# EAGLE design mbed-motherboard (EAGLE 5.11)
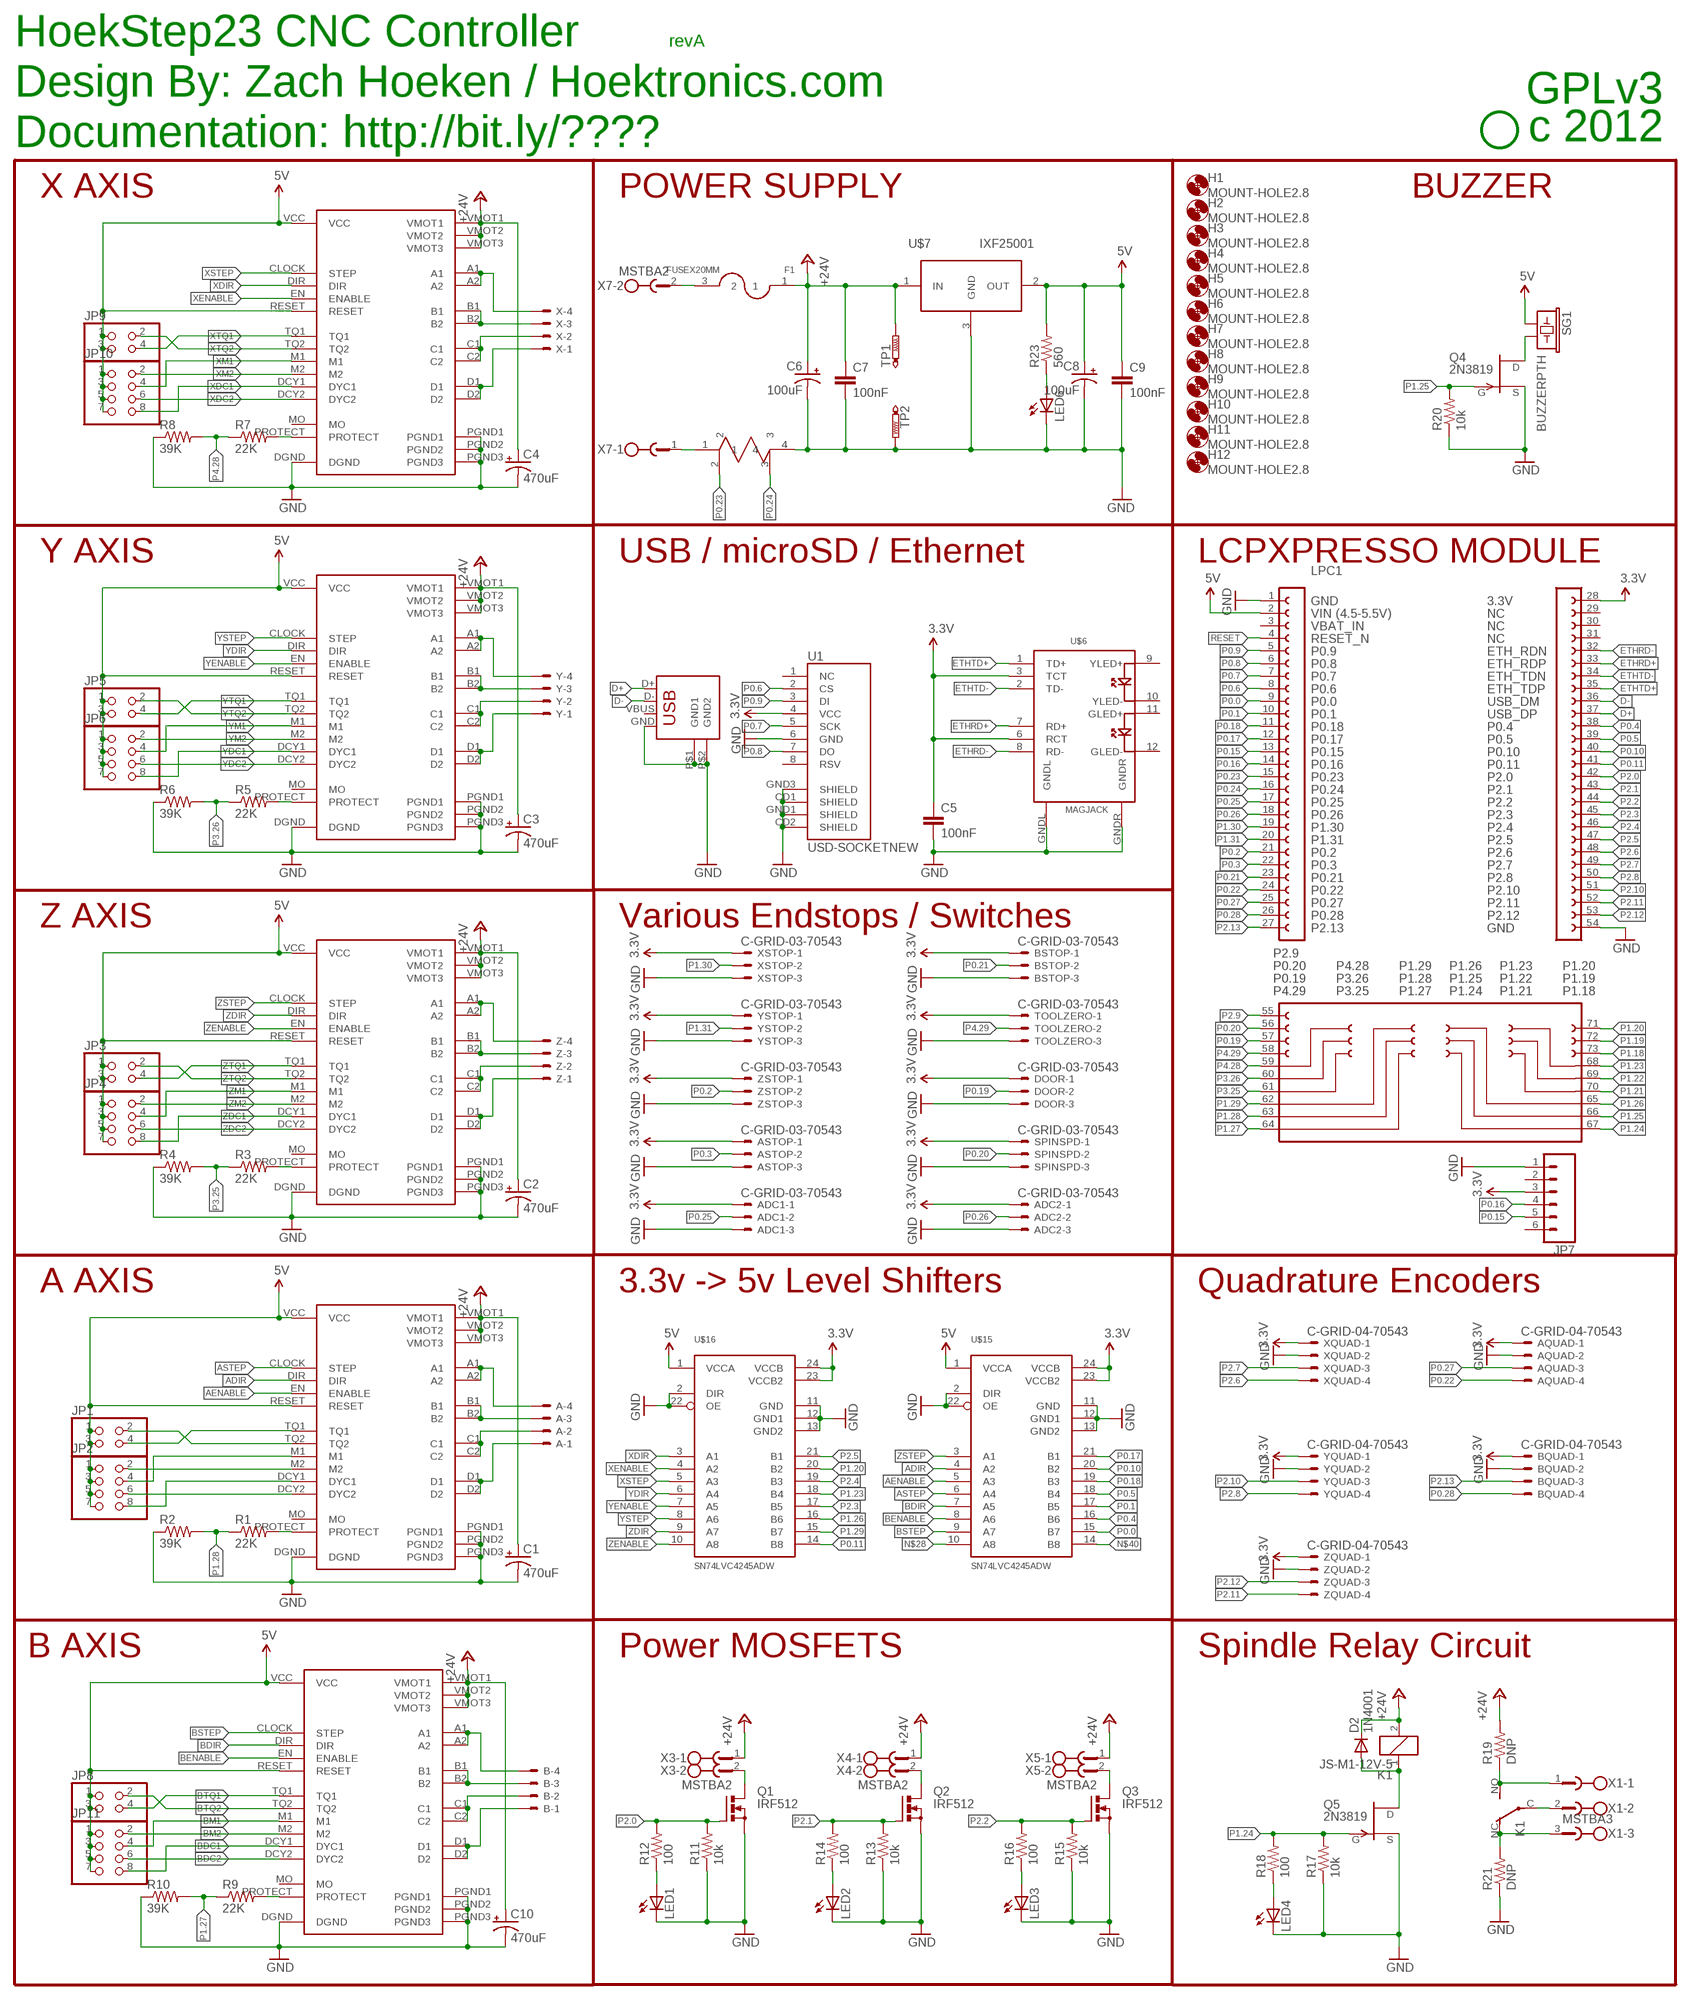
[diagram p0: schematic, sheet 1]

## Parts
A  KK-156-4  [KK-156-4]
ADC1  C-GRID-03-70543  [70543-03]
ADC2  C-GRID-03-70543  [70543-03]
AQUAD  C-GRID-04-70543  [70543-04]
ASTOP  C-GRID-03-70543  [70543-03]
B  KK-156-4  [KK-156-4]
BQUAD  C-GRID-04-70543  [70543-04]
BSTOP  C-GRID-03-70543  [70543-03]
C1  470uF  CPOL-USE3.5-8  [E3,5-8]
C2  470uF  CPOL-USE3.5-8  [E3,5-8]
C3  470uF  CPOL-USE3.5-8  [E3,5-8]
C4  470uF  CPOL-USE3.5-8  [E3,5-8]
C5  100nF  CAP0805  [0805]
C6  100uF  CPOL-USE2.5-7  [E2,5-7]
C7  100nF  CAP0805  [0805]
C8  100uF  CPOL-USE2.5-7  [E2,5-7]
C9  100nF  CAP0805  [0805]
C10  470uF  CPOL-USE3.5-8  [E3,5-8]
D2  1N4001  DIODEPTH  [DIODE-1N4001]
DOOR  C-GRID-03-70543  [70543-03]
F1  FUSEX20MM  [FUSE_5MM]
H1  MOUNT-HOLE2.8  [2,8]
H2  MOUNT-HOLE2.8  [2,8]
H3  MOUNT-HOLE2.8  [2,8]
H4  MOUNT-HOLE2.8  [2,8]
H5  MOUNT-HOLE2.8  [2,8]
H6  MOUNT-HOLE2.8  [2,8]
H7  MOUNT-HOLE2.8  [2,8]
H8  MOUNT-HOLE2.8  [2,8]
H9  MOUNT-HOLE2.8  [2,8]
H10  MOUNT-HOLE2.8  [2,8]
H11  MOUNT-HOLE2.8  [2,8]
H12  MOUNT-HOLE2.8  [2,8]
JP1  PINHD-2X2  [2X02]
JP2  PINHD-2X4  [2X04]
JP3  PINHD-2X2  [2X02]
JP4  PINHD-2X4  [2X04]
JP5  PINHD-2X2  [2X02]
JP6  PINHD-2X4  [2X04]
JP7  M06SIP  [1X06]
JP8  PINHD-2X2  [2X02]
JP9  PINHD-2X2  [2X02]
JP10  PINHD-2X4  [2X04]
JP11  PINHD-2X4  [2X04]
K1  JS-M1-12V-5  [JS-M]
LED1  LED1206  [LED-1206]
LED2  LED1206  [LED-1206]
LED3  LED1206  [LED-1206]
LED4  LED1206  [LED-1206]
LED6  LED1206  [LED-1206]
LPC1  LPCXPRESSO_LPC1769  [LPCXPRESSO_LPC1769]
Q1  IRF512  [TO220BV]
Q2  IRF512  [TO220BV]
Q3  IRF512  [TO220BV]
Q4  2N3819  [TO92]
Q5  2N3819  [TO92]
R1  22K  R-US_R0805  [R0805]
R2  39K  R-US_R0805  [R0805]
R3  22K  R-US_R0805  [R0805]
R4  39K  R-US_R0805  [R0805]
R5  22K  R-US_R0805  [R0805]
R6  39K  R-US_R0805  [R0805]
R7  22K  R-US_R0805  [R0805]
R8  39K  R-US_R0805  [R0805]
R9  22K  R-US_R0805  [R0805]
R10  39K  R-US_R0805  [R0805]
R11  10k  R-US_R0805  [R0805]
R12  100  R-US_R0805  [R0805]
R13  10k  R-US_R0805  [R0805]
R14  100  R-US_R0805  [R0805]
R15  10k  R-US_R0805  [R0805]
R16  100  R-US_R0805  [R0805]
R17  10k  R-US_R0805  [R0805]
R18  100  R-US_R0805  [R0805]
R19  DNP  R-US_R2512  [R2512]
R20  10k  R-US_R0805  [R0805]
R21  DNP  R-US_R2512  [R2512]
R23  560  R-US_R0805  [R0805]
SG1  BUZZERPTH  [BUZZER-12MM]
SPINSPD  C-GRID-03-70543  [70543-03]
TOOLZERO  C-GRID-03-70543  [70543-03]
TP1  PTR1PAD1-13  [P1-13]
TP2  PTR1PAD1-13  [P1-13]
U1  USD-SOCKETNEW  [MICRO-SD-SOCKET-PP]
U$1  HOEKSTEP23  [HOEKSTEP23]
U$2  HOEKSTEP23  [HOEKSTEP23]
U$3  HOEKSTEP23  [HOEKSTEP23]
U$4  HOEKSTEP23  [HOEKSTEP23]
U$6  MAGJACK  [MAGJACK]
U$7  IXF25001  [TO252]
U$9  HOEKSTEP23  [HOEKSTEP23]
U$15  SN74LVC4245ADW  [SO24W]
U$16  SN74LVC4245ADW  [SO24W]
U$19  WSL3637  [WSL3637]
X  KK-156-4  [KK-156-4]
X1  MSTBA3  [MSTBA3]
X2  USBPTH  [USB-B-PTH]
X3  MSTBA2  [MSTBA2]
X4  MSTBA2  [MSTBA2]
X5  MSTBA2  [MSTBA2]
X7  MSTBA2  [MSTBA2]
XQUAD  C-GRID-04-70543  [70543-04]
XSTOP  C-GRID-03-70543  [70543-03]
Y  KK-156-4  [KK-156-4]
YQUAD  C-GRID-04-70543  [70543-04]
YSTOP  C-GRID-03-70543  [70543-03]
Z  KK-156-4  [KK-156-4]
ZQUAD  C-GRID-04-70543  [70543-04]
ZSTOP  C-GRID-03-70543  [70543-03]

## Nets
3.3V: ADC1.1 ADC2.1 AQUAD.1 ASTOP.1 BQUAD.1 BSTOP.1 C5.1 DOOR.1 JP7.3 LPC1.28 SPINSPD.1 TOOLZERO.1 U1.4(VCC) U$6.3(TCT) U$6.6(RCT) U$15.23(VCCB2) U$15.24(VCCB) U$16.23(VCCB2) U$16.24(VCCB) XQUAD.1 XSTOP.1 YQUAD.1 YSTOP.1 ZQUAD.1 ZSTOP.1
5V: C8.+ C9.1 JP1.1 JP1.3 JP2.1 JP2.3 JP2.5 JP2.7 JP3.1 JP3.3 JP4.1 JP4.3 JP4.5 JP4.7 JP5.1 JP5.3 JP6.1 JP6.3 JP6.5 JP6.7 JP8.1 JP8.3 JP9.1 JP9.3 JP10.1 JP10.3 JP10.5 JP10.7 JP11.1 JP11.3 JP11.5 JP11.7 LPC1.2 R23.2 SG1.+ U$1.RESET U$1.VCC U$2.RESET U$2.VCC U$3.RESET U$3.VCC U$4.RESET U$4.VCC U$7.2(OUT) U$9.RESET U$9.VCC U$15.1(VCCA) U$16.1(VCCA)
+24V [power]: C1.+ C2.+ C3.+ C4.+ C6.+ C7.1 C10.+ D2.C F1.1 K1.2 R19.2 TP1.TP U$1.VMOT1 U$1.VMOT2 U$1.VMOT3 U$2.VMOT1 U$2.VMOT2 U$2.VMOT3 U$3.VMOT1 U$3.VMOT2 U$3.VMOT3 U$4.VMOT1 U$4.VMOT2 U$4.VMOT3 U$7.1(IN) U$9.VMOT1 U$9.VMOT2 U$9.VMOT3 X3.1 X4.1 X5.1
ADC1 [power]: JP2.8 U$4.DCY1(DYC1)
ADC2 [power]: JP2.6 U$4.DCY2(DYC2)
ADIR: U$4.DIR U$15.4(A2)
AENABLE: U$4.EN(ENABLE) U$15.5(A3)
AM1 [power]: JP2.4 U$4.M1
AM2 [power]: JP2.2 U$4.M2
ASTEP: U$4.CLOCK(STEP) U$15.6(A4)
ATQ1 [power]: JP1.4 U$4.TQ1
ATQ2 [power]: JP1.2 U$4.TQ2
BDC1 [power]: JP11.8 U$9.DCY1(DYC1)
BDC2 [power]: JP11.6 U$9.DCY2(DYC2)
BDIR: U$9.DIR U$15.7(A5)
BENABLE: U$9.EN(ENABLE) U$15.8(A6)
BM1 [power]: JP11.4 U$9.M1
BM2 [power]: JP11.2 U$9.M2
BSTEP: U$9.CLOCK(STEP) U$15.9(A7)
BTQ1 [power]: JP8.4 U$9.TQ1
BTQ2 [power]: JP8.2 U$9.TQ2
D+: LPC1.37 X2.D+
D-: LPC1.36 X2.D-
ETHRD+: LPC1.33 U$6.7(RD+)
ETHRD-: LPC1.32 U$6.8(RD-)
ETHTD+: LPC1.35 U$6.1(TD+)
ETHTD-: LPC1.34 U$6.2(TD-)
GND: ADC1.3 ADC2.3 AQUAD.2 ASTOP.3 BQUAD.2 BSTOP.3 C1.- C2.- C3.- C4.- C5.2 C6.- C7.2 C8.- C9.2 C10.- DOOR.3 JP7.1 LED1.C LED2.C LED3.C LED4.C LED6.C LPC1.1 LPC1.54 Q1.S Q2.S Q3.S Q4.3(S) Q5.3(S) R2.1 R4.1 R6.1 R8.1 R10.1 R11.1 R13.1 R15.1 R17.1 R20.1 R21.1 SPINSPD.3 TOOLZERO.3 TP2.TP U1.6(GND) U1.CD1(SHIELD) U1.CD2(SHIELD) U1.GND1(SHIELD) U1.GND3(SHIELD) U$1.DGND U$1.PGND1 U$1.PGND2 U$1.PGND3 U$2.DGND U$2.PGND1 U$2.PGND2 U$2.PGND3 U$3.DGND U$3.PGND1 U$3.PGND2 U$3.PGND3 U$4.DGND U$4.PGND1 U$4.PGND2 U$4.PGND3 U$6.GNDL U$6.GNDR U$7.3(GND) U$9.DGND U$9.PGND1 U$9.PGND2 U$9.PGND3 U$15.2(DIR) U$15.11(GND) U$15.12(GND1) U$15.13(GND2) U$15.22(OE) U$16.2(DIR) U$16.11(GND) U$16.12(GND1) U$16.13(GND2) U$16.22(OE) U$19.4 X2.GND X2.P$1(GND1) X2.P$2(GND2) XQUAD.2 XSTOP.3 YQUAD.2 YSTOP.3 ZQUAD.2 ZSTOP.3
N$1 [power]: U$3.C1 U$3.C2 Z.2
N$2 [power]: A.2 U$4.C1 U$4.C2
N$3 [power]: A.3 U$4.B1 U$4.B2
N$4 [power]: A.4 U$4.A1 U$4.A2
N$5 [power]: A.1 U$4.D1 U$4.D2
N$6: F1.3 X7.2
N$7 [power]: B.2 U$9.C1 U$9.C2
N$8: R3.2 U$3.PROTECT
N$9 [power]: U$3.B1 U$3.B2 Z.3
N$10 [power]: U$3.A1 U$3.A2 Z.4
N$11 [power]: U$3.D1 U$3.D2 Z.1
N$12 [power]: B.3 U$9.B1 U$9.B2
N$13 [power]: B.4 U$9.A1 U$9.A2
N$14 [power]: B.1 U$9.D1 U$9.D2
N$15: K1.NO(2:S) R19.1 X1.1
N$16: R1.2 U$4.PROTECT
N$17: Q1.D X3.2
N$18: LED1.A R12.1
N$19: Q2.D X4.2
N$20: LED2.A R14.1
N$21 [power]: U$2.C1 U$2.C2 Y.2
N$22 [power]: U$2.B1 U$2.B2 Y.3
N$23 [power]: U$2.A1 U$2.A2 Y.4
N$24 [power]: U$2.D1 U$2.D2 Y.1
N$25: Q3.D X5.2
N$26: LED3.A R16.1
N$27: U$19.1 X7.1
N$28: U$15.10(A8)
N$29: K1.C(2:P) X1.2
N$30: D2.A K1.1 Q5.1(D)
N$31 [power]: U$1.C1 U$1.C2 X.2
N$32 [power]: U$1.B1 U$1.B2 X.3
N$33 [power]: U$1.A1 U$1.A2 X.4
N$34 [power]: U$1.D1 U$1.D2 X.1
N$35: LED4.A R18.1
N$37: K1.NC(2:O) R21.2 X1.3
N$38: Q4.1(D) SG1.-
N$39: LED6.A R23.1
N$40: U$15.14(B8)
N$42: R9.2 U$9.PROTECT
N$43: R7.2 U$1.PROTECT
N$44: R5.2 U$2.PROTECT
P0.0: LPC1.9 U$15.15(B7)
P0.1: LPC1.10 U$15.17(B5)
P0.2: LPC1.21 ZSTOP.2
P0.3: ASTOP.2 LPC1.22
P0.4: LPC1.38 U$15.16(B6)
P0.5: LPC1.39 U$15.18(B4)
P0.6: LPC1.8 U1.2(CS)
P0.7: LPC1.7 U1.5(SCK)
P0.8: LPC1.6 U1.7(DO)
P0.9: LPC1.5 U1.3(DI)
P0.10: LPC1.40 U$15.20(B2)
P0.11: LPC1.41 U$16.14(B8)
P0.15: JP7.5 LPC1.13
P0.16: JP7.4 LPC1.14
P0.17: LPC1.12 U$15.21(B1)
P0.18: LPC1.11 U$15.19(B3)
P0.19: DOOR.2 LPC1.57
P0.20: LPC1.56 SPINSPD.2
P0.21: BSTOP.2 LPC1.23
P0.22: AQUAD.4 LPC1.24
P0.23: LPC1.15 U$19.2
P0.24: LPC1.16 U$19.3
P0.25: ADC1.2 LPC1.17
P0.26: ADC2.2 LPC1.18
P0.27: AQUAD.3 LPC1.25
P0.28: BQUAD.4 LPC1.26
P1.18: LPC1.73
P1.19: LPC1.72
P1.20: LPC1.71 U$16.20(B2)
P1.21: LPC1.70
P1.22: LPC1.69
P1.23: LPC1.68 U$16.18(B4)
P1.24: LPC1.67 Q5.2(G) R17.2 R18.2
P1.25: LPC1.66 Q4.2(G) R20.2
P1.26: LPC1.65 U$16.16(B6)
P1.27: LPC1.64 R9.1 R10.2
P1.28: LPC1.63 R1.1 R2.2
P1.29: LPC1.62 U$16.15(B7)
P1.30: LPC1.19 XSTOP.2
P1.31: LPC1.20 YSTOP.2
P2.0: LPC1.42 Q1.G R11.2 R12.2
P2.1: LPC1.43 Q2.G R13.2 R14.2
P2.2: LPC1.44 Q3.G R15.2 R16.2
P2.3: LPC1.45 U$16.17(B5)
P2.4: LPC1.46 U$16.19(B3)
P2.5: LPC1.47 U$16.21(B1)
P2.6: LPC1.48 XQUAD.4
P2.7: LPC1.49 XQUAD.3
P2.8: LPC1.50 YQUAD.4
P2.9: LPC1.55
P2.10: LPC1.51 YQUAD.3
P2.11: LPC1.52 ZQUAD.4
P2.12: LPC1.53 ZQUAD.3
P2.13: BQUAD.3 LPC1.27
P3.25: LPC1.61 R3.1 R4.2
P3.26: LPC1.60 R5.1 R6.2
P4.28: LPC1.59 R7.1 R8.2
P4.29: LPC1.58 TOOLZERO.2
RESET: LPC1.4
XDC1 [power]: JP10.8 U$1.DCY1(DYC1)
XDC2 [power]: JP10.6 U$1.DCY2(DYC2)
XDIR: U$1.DIR U$16.3(A1)
XENABLE: U$1.EN(ENABLE) U$16.4(A2)
XM1 [power]: JP10.4 U$1.M1
XM2 [power]: JP10.2 U$1.M2
XSTEP: U$1.CLOCK(STEP) U$16.5(A3)
XTQ1 [power]: JP9.4 U$1.TQ1
XTQ2 [power]: JP9.2 U$1.TQ2
YDC1 [power]: JP6.8 U$2.DCY1(DYC1)
YDC2 [power]: JP6.6 U$2.DCY2(DYC2)
YDIR: U$2.DIR U$16.6(A4)
YENABLE: U$2.EN(ENABLE) U$16.7(A5)
YM1 [power]: JP6.4 U$2.M1
YM2 [power]: JP6.2 U$2.M2
YSTEP: U$2.CLOCK(STEP) U$16.8(A6)
YTQ1 [power]: JP5.4 U$2.TQ1
YTQ2 [power]: JP5.2 U$2.TQ2
ZDC1 [power]: JP4.8 U$3.DCY1(DYC1)
ZDC2 [power]: JP4.6 U$3.DCY2(DYC2)
ZDIR: U$3.DIR U$16.9(A7)
ZENABLE: U$3.EN(ENABLE) U$16.10(A8)
ZM1 [power]: JP4.4 U$3.M1
ZM2 [power]: JP4.2 U$3.M2
ZSTEP: U$3.CLOCK(STEP) U$15.3(A1)
ZTQ1 [power]: JP3.4 U$3.TQ1
ZTQ2 [power]: JP3.2 U$3.TQ2
Unconnected: JP7.2 JP7.6 LPC1.3 LPC1.29 LPC1.30 LPC1.31 U1.1(NC) U1.8(RSV) U$1.MO U$2.MO U$3.MO U$4.MO U$6.9(YLED+) U$6.10(YLED-) U$6.11(GLED+) U$6.12(GLED-) U$9.MO X2.VBUS

## Notes on the sheet
- HoekStep23 CNC Controller | revA
- GPLv3
- Design By: Zach Hoeken / Hoektronics.com | c 2012
- Documentation: http://bit.ly/????
- X AXIS | POWER SUPPLY | BUZZER
- Y AXIS | USB / microSD / Ethernet | LCPXPRESSO MODULE
- Z AXIS | Various Endstops / Switches
- A AXIS | 3.3v -> 5v Level Shifters | Quadrature Encoders
- B AXIS | Power MOSFETS | Spindle Relay Circuit

## Library data of the parts
A B X Y Z = con-molex:KK-156-4: KK 156 HEADER Source: http://www.molex.com/pdm_docs/sd/026604100_sd.pdf; OC_FARNELL: unknown; OC_NEWARK: unknown
ADC1 ADC2 ASTOP BSTOP DOOR SPINSPD TOOLZERO XSTOP YSTOP ZSTOP = con-molex:C-GRID-03: CONNECTOR wire to board 2.54 mm (0.100") pitch header; OC_FARNELL: unknown; OC_NEWARK: unknown
AQUAD BQUAD XQUAD YQUAD ZQUAD = con-molex:C-GRID-04: CONNECTOR wire to board 2.54 mm (0.100") pitch header; OC_FARNELL: unknown; OC_NEWARK: unknown
C1-C4 C6 C8 C10 = rcl:CPOL-US: POLARIZED CAPACITOR, American symbol
C5 C7 C9 = SparkFun:CAP: Capacitor Standard 0603 ceramic capacitor, and 0.1" leaded capacitor.
D2 = SparkFun:DIODE: Diode These are standard reverse protection diodes and small signal diodes. SMA package can handle up to about 1A. SOD-323 can handle about 200mA. What the SOD-323 package when ordering, there are some mfgs out there that are 5-pin packages.
F1 = SparkFun:FUSE
H1-H12 = holes:MOUNT-HOLE: MOUNTING HOLE with drill center marker
JP1 JP3 JP5 JP8 JP9 = pinhead:PINHD-2X2: PIN HEADER
JP2 JP4 JP6 JP10 JP11 = pinhead:PINHD-2X4: PIN HEADER
JP7 = SparkFun:M06: Header 6 Standard 6-pin 0.1" header. Use with straight break away headers (SKU : PRT-00116), right angle break away headers (PRT-00553), swiss pins (PRT-00743), machine pins (PRT-00117), and female headers (PRT-00115). Molex polarized connector foot print use with SKU : PRT-08094 with associated crimp pins and housings. NOTES ON THE VARIANTS LOCK and LOCK_LONGPADS... This footprint was designed to help hold the alignment of a through-hole component (i.e. 6-pin header) while soldering it into place. You may notice that each hole has been shifted either up or down by 0.005 of an inch from it's more standard position (which is a perfectly straight line). This slight alteration caused the pins (the squares in the middle) to touch the edges of the holes. Because they are alternating, it causes a "brace" to hold the component in place. 0.005 has proven to be the perfect amount of "off-center" position when using our standard breakaway headers. Although looks a little odd when you look at the bare footprint, once you have a header in there, the alteration is very hard to notice. Also, if you push a header all the way into place, it is covered up entirely on the bottom side. This idea of altering the position of holes to aid alignment will be further integrated into the Sparkfun Library for other footprints. It can help hold any component with 3 or more connection pins.
K1 = relay:JS-M1*: Automotive Ultra-Miniature Power Relay NAiS Source: http://www.mew-europe.com/.. en_ds_61211_0000.pdf
LED1-LED4 LED6 = SparkFun:LED: LEDs Standard schematic elements and footprints for 5mm, 3mm, 1206, and 0603 sized LEDs. 5mm - Spark Fun Electronics SKU : COM-00529 (and others)
LPC1 = LPCXpresso_boards:LPCXPRESSO_LPC1769
Q1-Q3 = transistor-power:IRF512: N-CHANNEL MOS FET
Q4 Q5 = transistor-fet:2N3819: N-Channel Junction FET
R1-R21 R23 = resistor:R-US_: RESISTOR, American symbol
SG1 = SparkFun:BUZZER: Buzzer 12mm Spark Fun Electronics SKU : Comp-Buzzer
TP1 TP2 = testpad:PTR1: TEST PIN
U1 = SparkFun:USD-SOCKET: microSD Socket Push-push type uSD socket. Schematic element and footprint production proven. Spark Fun Electronics SKU : PRT-00127. tDoc lines correctly indicate media card edge positions when inserting (unlocked, locked, depressed).
U$1-U$4 U$9 = Hoektronics:HOEKSTEP23
U$6 = Hoektronics:MAGJACK
U$7 = Hoektronics:IXF25001
U$15 U$16 = MakerBot:SN74LVC4245A
U$19 = Hoektronics:WSL3637
X1 = con-phoenix-508:MSTBA3: PHOENIX; MF: FARNELL; MPN: 1757255; OC_FARNELL: 3705183; OC_NEWARK: 71C4162
X2 = Hoektronics:USB: USB Connectors USB-B-PTH is fully proven SKU : PRT-00139 USB-miniB is fully proven SKU : PRT-00587 USB-A-PCB is untested. USB-A-H is throughly reviewed, but untested. Spark Fun Electronics SKU : PRT-00437 USB-B-SMT is throughly reviewed, but untested. Needs silkscreen touching up. USB-A-S has not been used/tested USB-MB-H has not been used/tested
X3-X5 X7 = con-phoenix-508:MSTBA2: PHOENIX; MF: FARNELL; MPN: 1757242; OC_FARNELL: 3705171; OC_NEWARK: 71C4161

## Net classes
0 default: width 0.406 mm, clearance 0.381 mm
1 power: width 1.27 mm, clearance 0.635 mm

## Board
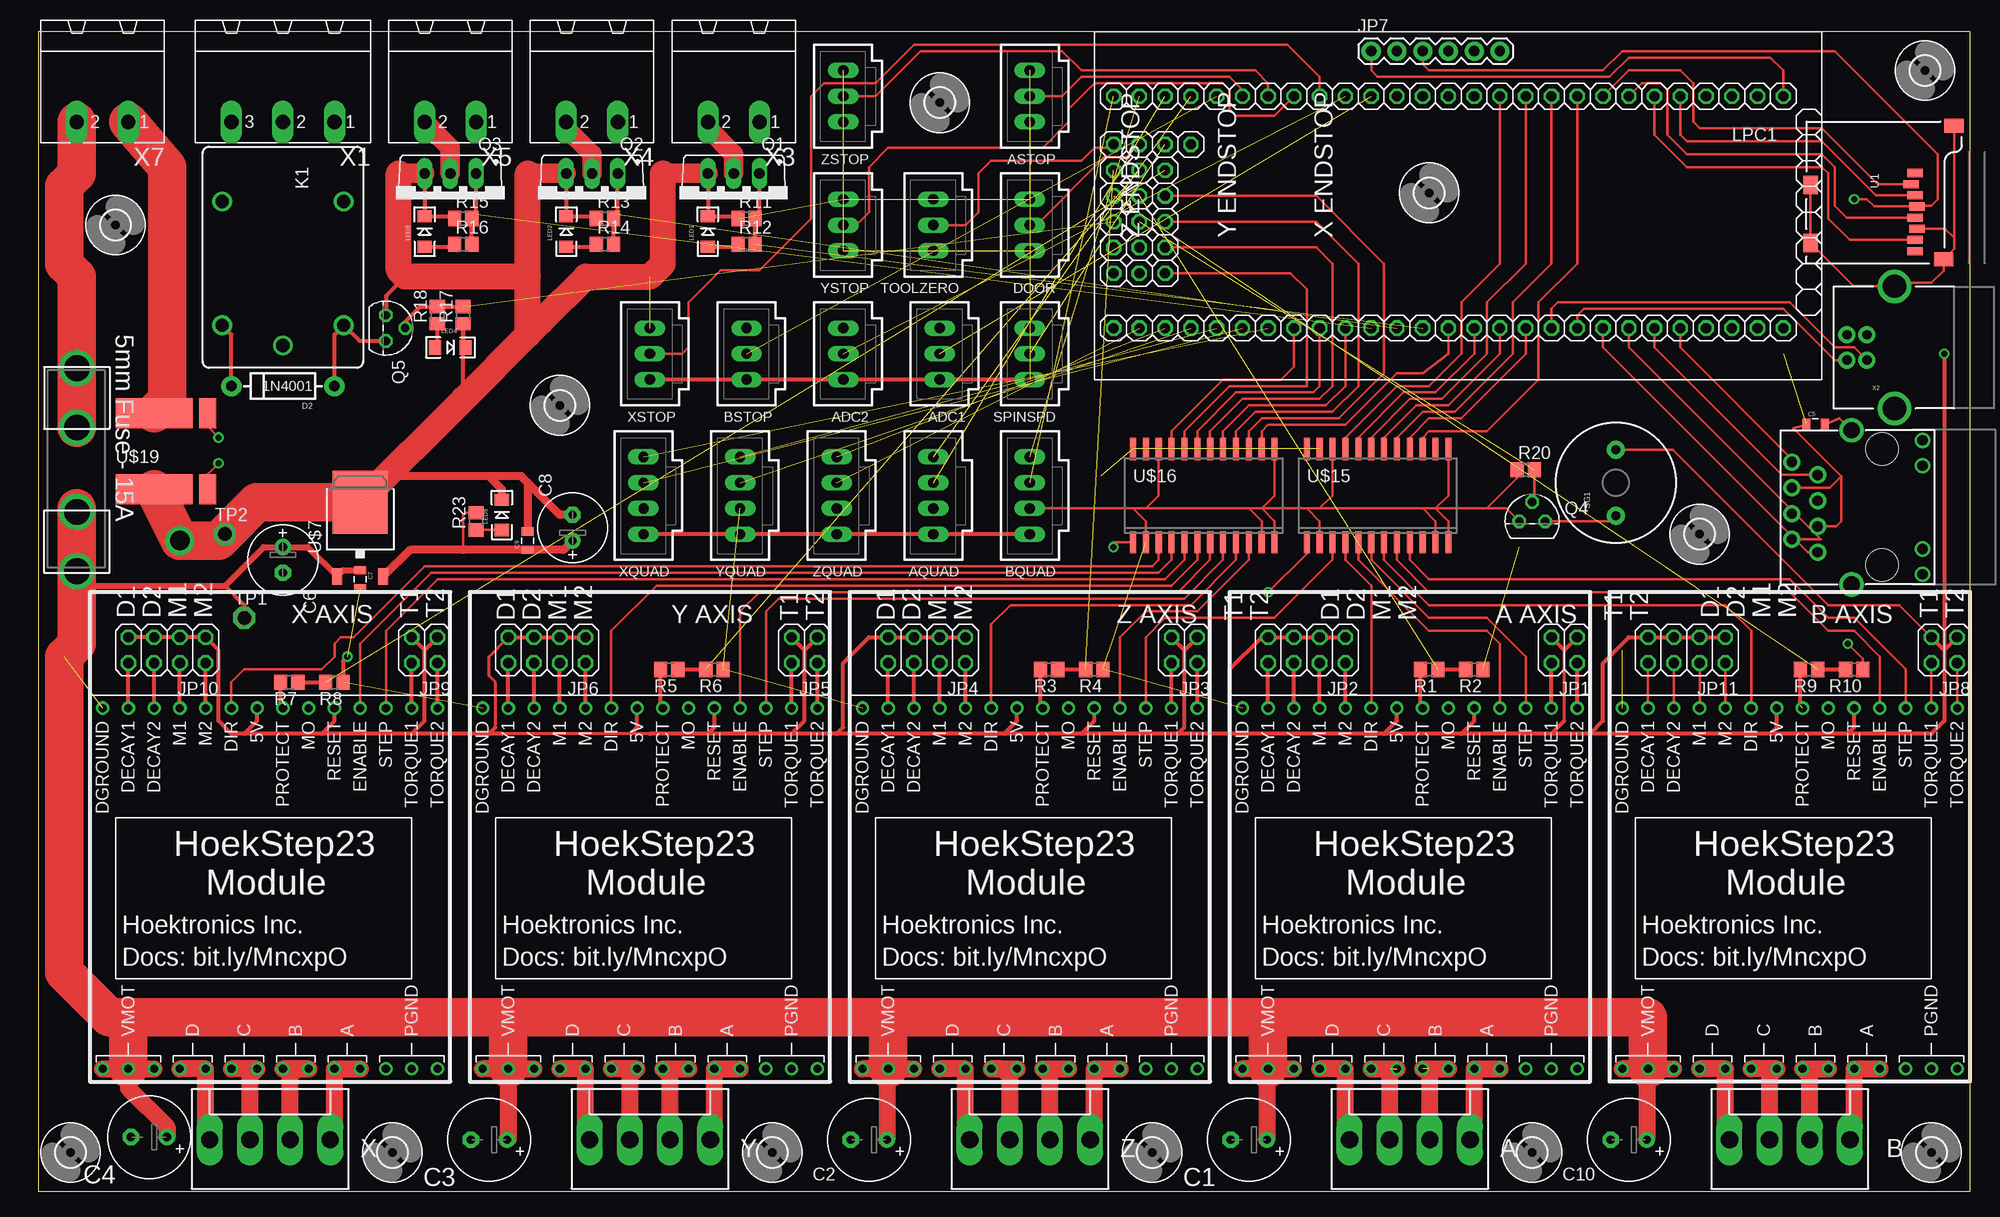
[diagram p1: board, top side]
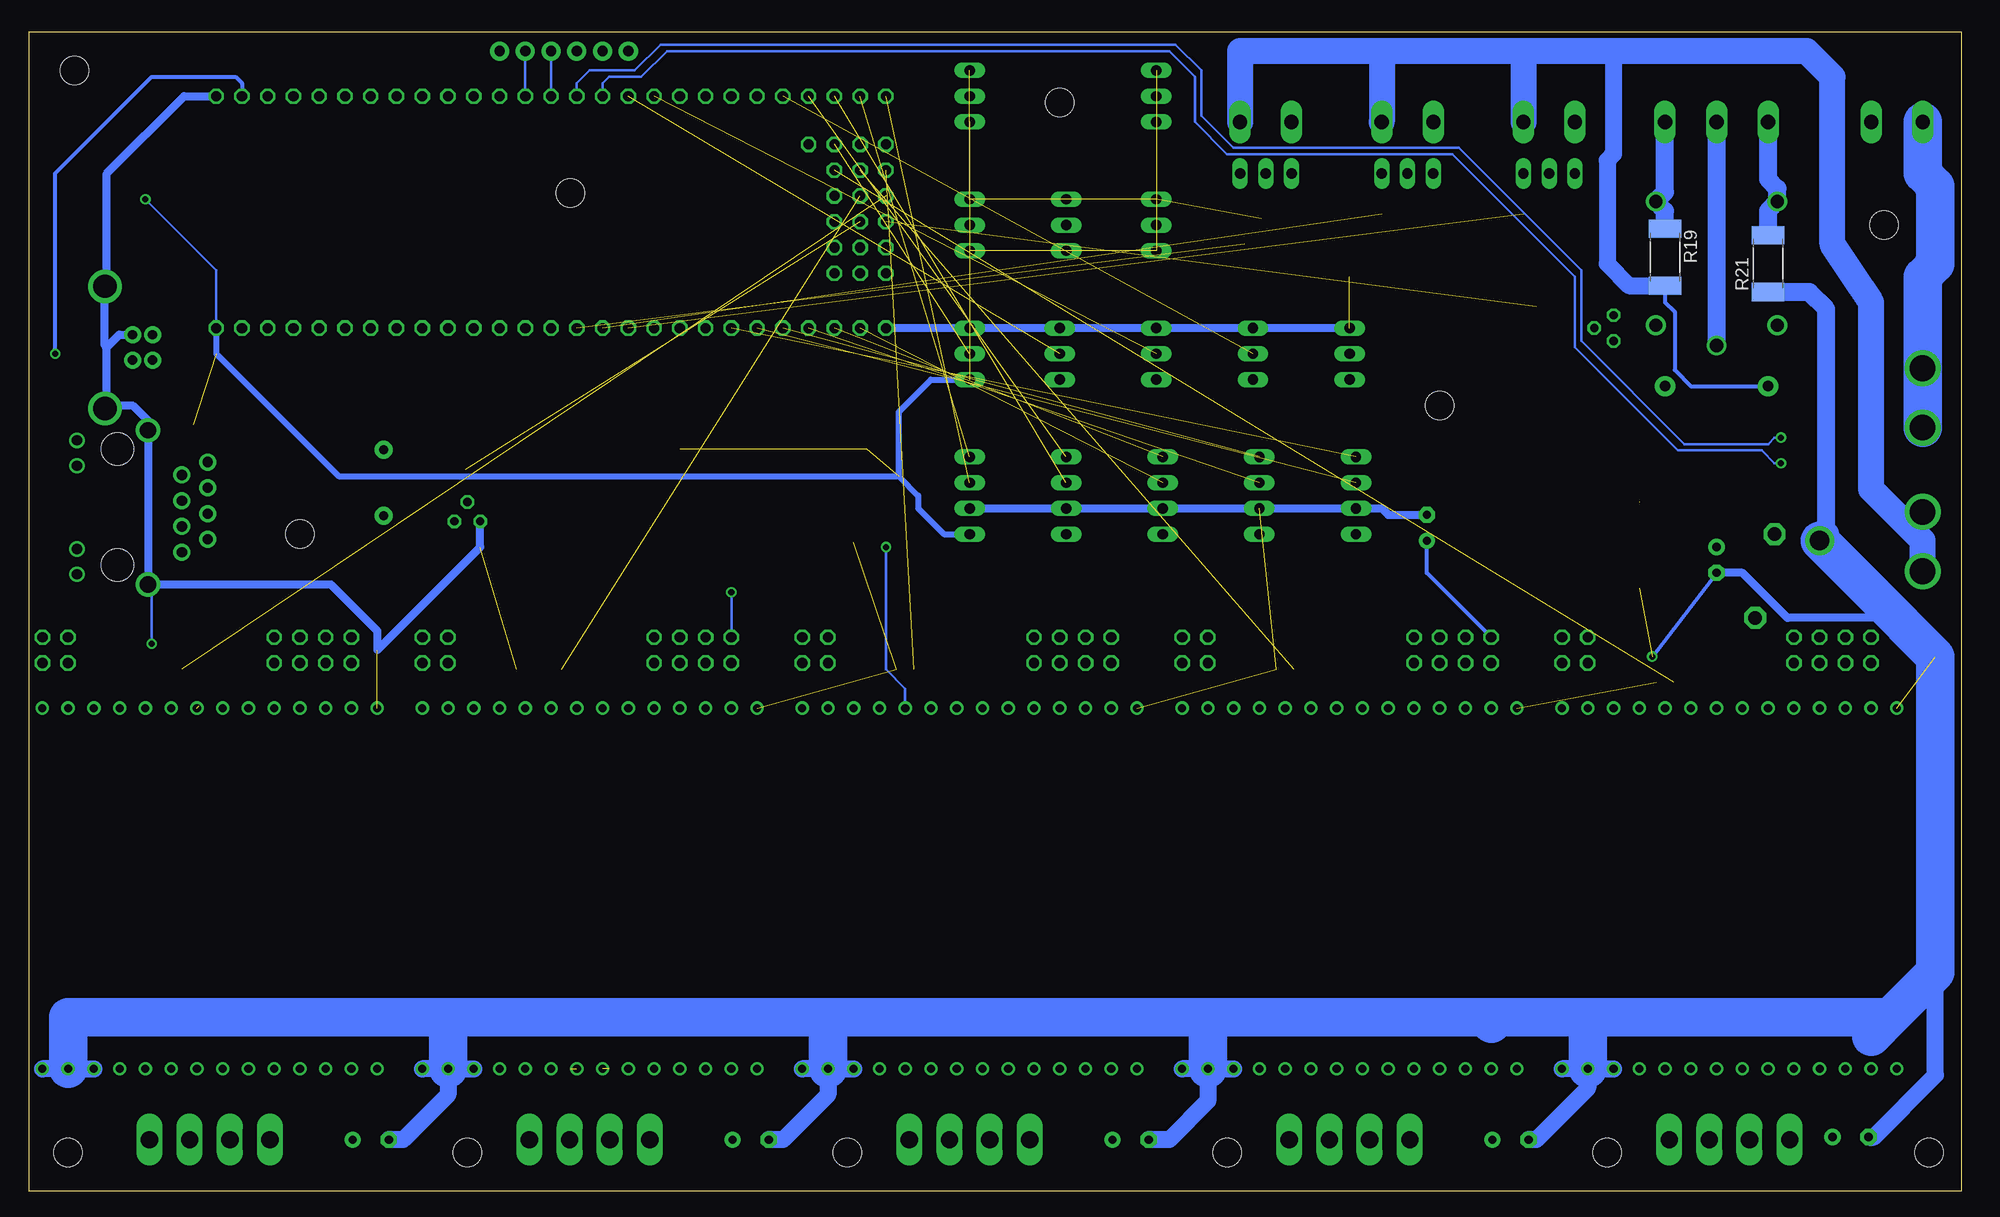
[diagram p2: board, bottom side, seen from below]

Size 190.5 x 114.3 mm. Coordinates in mm from the lower left corner, seen from the top.
Outline: 190.5,114.3 0,114.3 0,0 190.5,0 190.5,114.3
Copper layers (1*16): Top 0.035mm / dielectric 1.5mm / Bottom 0.035mm
Design rules "default *": minimum track width 10mil, minimum drill 24mil, track to track 15mil, track to pad 15mil, pad to pad 15mil, via to via 15mil, smd to smd 15mil, copper to edge 25mil, drill to drill 15mil, minimum pad ring 10mil, minimum via ring 8mil, stop-mask expansion 4mil, vias tented up to drill 0mil, thermal gap 10mil

### Footprints (pad centres in the part's own frame; a part is rotated, then mirrored left to right if it is on the bottom)
KK-156-4 = drill 1.7 pad 2.184 long: 1 -5.94,0; 2 -1.98,0; 3 1.98,0; 4 5.94,0
70543-03 = drill 1.016 long: 1 -2.54,0; 2 0,0; 3 2.54,0
70543-04 = drill 1.016 long: 1 -3.81,0; 2 -1.27,0; 3 1.27,0; 4 3.81,0
E3,5-8 = drill 0.813 pad 1.6 round: + -1.778,0 | drill 0.813 pad 1.6 octagon: - 1.778,0
0805 = smd 0.8 x 1.2: 1 -0.9,0; 2 0.9,0
E2,5-7 = drill 0.813 pad 1.6 round: + -1.27,0 | drill 0.813 pad 1.6 octagon: - 1.27,0
DIODE-1N4001 = drill 1 pad 1.981 round: A -5.08,0; C 5.08,0
FUSE_5MM = drill 2.54 pad 3.556 round: 1 0,-10; 2 0,-4.158; 3 0,4.158; 4 0,10
2,8 = hole 2.8: 0,0
2X02 = drill 1.016 octagon: 1 -1.27,-1.27; 2 -1.27,1.27; 3 1.27,-1.27; 4 1.27,1.27
2X04 = drill 1.016 octagon: 1 -3.81,-1.27; 2 -3.81,1.27; 3 -1.27,-1.27; 4 -1.27,1.27; 5 1.27,-1.27; 6 1.27,1.27; 7 3.81,-1.27; 8 3.81,1.27
1X06 = drill 1.016 pad 1.88 round: 1 0,0; 2 2.54,0; 3 5.08,0; 4 7.62,0; 5 10.16,0; 6 12.7,0
JS-M = drill 1.3 round: 1 6.7,6; 2 6.7,-6; C 8.7,0; NC -5.5,-6; NO -5.5,6
LED-1206 = smd 1.2 x 1.4: A -1.5,0; C 1.5,0
LPCXPRESSO_LPC1769 = drill 1 octagon: 1 3.81,6.35; 2 6.35,6.35; 3 8.89,6.35; 4 11.43,6.35; 5 13.97,6.35; 6 16.51,6.35; 7 19.05,6.35; 8 21.59,6.35; 9 24.13,6.35; 10 26.67,6.35; 11 29.21,6.35; 12 31.75,6.35; 13 34.29,6.35; 14 36.83,6.35; 15 39.37,6.35; 16 41.91,6.35; 17 44.45,6.35; 18 46.99,6.35; 19 49.53,6.35; 20 52.07,6.35; 21 54.61,6.35; 22 57.15,6.35; 23 59.69,6.35; 24 62.23,6.35; 25 64.77,6.35; 26 67.31,6.35; 27 69.85,6.35; 28 3.81,29.21; 29 6.35,29.21; 30 8.89,29.21; 31 11.43,29.21; 32 13.97,29.21; 33 16.51,29.21; 34 19.05,29.21; 35 21.59,29.21; 36 24.13,29.21; 37 26.67,29.21; 38 29.21,29.21; 39 31.75,29.21; 40 34.29,29.21; 41 36.83,29.21; 42 39.37,29.21; 43 41.91,29.21; 44 44.45,29.21; 45 46.99,29.21; 46 49.53,29.21; 47 52.07,29.21; 48 54.61,29.21; 49 57.15,29.21; 50 59.69,29.21; 51 62.23,29.21; 52 64.77,29.21; 53 67.31,29.21; 54 69.85,29.21; 55 62.23,11.1; 56 64.77,11.1; 57 67.31,11.1; 58 69.85,11.1; 59 64.77,13.64; 60 67.31,13.64; 61 69.85,13.64; 62 64.77,16.18; 63 67.31,16.18; 64 69.85,16.18; 65 64.77,18.72; 66 67.31,18.72; 67 69.85,18.72; 68 64.77,21.26; 69 67.31,21.26; 70 69.85,21.26; 71 64.77,23.8; 72 67.31,23.8; 73 69.85,23.8
TO220BV = drill 1.016 long: D 0,-2.54; G -2.54,-2.54; S 2.54,-2.54
TO92 = drill 0.813 octagon: 1 1.27,0; 2 0,1.905; 3 -1.27,0
R0805 = smd 1.3 x 1.5: 1 -0.85,0; 2 0.85,0
R2512 = smd 1.8 x 3.2: 1 -2.8,0; 2 2.8,0
BUZZER-12MM = drill 0.9 pad 1.778 round: + 3.25,0; - -3.25,0
P1-13 = drill 1.321 pad 2.159 octagon: TP 0,0
MICRO-SD-SOCKET-PP = smd 0.8 x 1.5: 1 -8.94,10.7; 2 -7.84,10.3; 3 -6.74,10.7; 4 -5.64,10.9; 5 -4.54,10.7; 6 -3.44,10.9; 7 -2.34,10.7; 8 -1.24,10.7 | smd 1.8 x 1.4: CD1 -2.05,0.4; CD2 -7.75,0.4 | smd 1.4 x 1.9: GND1 -13.6,14.55; GND3 -0.45,13.55
HOEKSTEP23 = drill 0.8 round: A1 17.78,7.62; A2 17.78,5.08; B1 17.78,2.54; B2 17.78,0; C1 17.78,-2.54; C2 17.78,-5.08; CLOCK -17.78,10.16; D1 17.78,-7.62; D2 17.78,-10.16; DCY1 -17.78,-15.24; DCY2 -17.78,-12.7; DGND -17.78,-17.78; DIR -17.78,-5.08; EN -17.78,7.62; M1 -17.78,-10.16; M2 -17.78,-7.62; MO -17.78,2.54; PGND1 17.78,15.24; PGND2 17.78,12.7; PGND3 17.78,10.16; PROTECT -17.78,0; RESET -17.78,5.08; TQ1 -17.78,12.7; TQ2 -17.78,15.24; VCC -17.78,-2.54; VMOT1 17.78,-12.7; VMOT2 17.78,-15.24; VMOT3 17.78,-17.78
MAGJACK = drill 1 pad 1.676 round: 1 3.175,17.445; 2 4.445,19.985; 3 5.715,17.445; 4 6.985,19.985; 5 8.255,17.445; 6 9.525,19.985; 7 10.795,17.445; 8 12.065,19.985 | drill 1 pad 1.27 round: 9 1,7.1; 10 3.5,7.1; 11 11.7,7.1; 12 14.2,7.1 | drill 1.6 pad 2.184 round: GNDL 0,14.1; GNDR 15.2,14.1 | hole 3.2: 1.905,11.095; 13.335,11.095
TO252 = smd 1 x 1.6: 1 -2.28,-4.8; 2 2.28,-4.8 | smd 5.4 x 6.2: 3 0,2.5
SO24W = smd 0.6 x 2.2: 1 -6.985,-4.6; 2 -5.715,-4.6; 3 -4.445,-4.6; 4 -3.175,-4.6; 5 -1.905,-4.6; 6 -0.635,-4.6; 7 0.635,-4.6; 8 1.905,-4.6; 9 3.175,-4.6; 10 4.445,-4.6; 11 5.715,-4.6; 12 6.985,-4.6; 13 6.985,4.6; 14 5.715,4.6; 15 4.445,4.6; 16 3.175,4.6; 17 1.905,4.6; 18 0.635,4.6; 19 -0.635,4.6; 20 -1.905,4.6; 21 -3.175,4.6; 22 -4.445,4.6; 23 -5.715,4.6; 24 -6.985,4.6
WSL3637 = smd 7.62 x 2.946: 1 3.81,8.738; 4 3.81,1.27 | smd 1.676 x 2.946: 2 9.068,8.738; 3 9.068,1.27
MSTBA3 = drill 1.397 long: 1 -5.08,5.08; 2 0,5.08; 3 5.08,5.08
USB-B-PTH = drill 0.914 pad 1.676 round: D+ 0,1.25; D- 1.981,1.25; GND 0,-1.25; VBUS 1.981,-1.25 | drill 2.286 round: P$1 -2.718,-6.02; P$2 -2.718,6.02
MSTBA2 = drill 1.397 long: 1 -2.54,5.08; 2 2.54,5.08

### Placement (x,y rotation side)
A  135.25,5.08 0 top
ADC1  88.9,82.55 90 top
ADC2  79.38,82.55 90 top
AQUAD  88.27,68.58 90 top
ASTOP  97.79,107.95 90 top
B  172.72,5.08 0 top
BQUAD  97.79,68.58 90 top
BSTOP  69.85,82.55 90 top
C1  119.38,5.08 180 top
C2  81.92,5.08 180 top
C3  44.45,5.08 180 top
C4  10.92,5.33 180 top
C5  175.26,75.56 0 top
C6  24.13,62.23 270 top
C7  31.75,60.33 270 top
C8  52.7,65.41 90 top
C9  48.26,64.14 90 top
C10  156.84,5.08 180 top
D2  24.13,79.38 180 top
DOOR  97.79,95.25 90 top
F1  3.81,71.12 0 top
H1  3.17,3.81 0 top
H2  34.92,3.81 0 top
H3  72.39,3.81 0 top
H4  109.86,3.81 0 top
H5  147.32,3.81 0 top
H6  186.69,3.81 0 top
H7  186.06,110.49 0 top
H8  163.83,64.77 0 top
H9  88.9,107.31 0 top
H10  7.62,95.25 0 top
H11  51.44,77.47 0 top
H12  137.16,98.42 0 top
JP1  150.5,53.34 180 top
JP2  125.09,53.34 180 top
JP3  113.03,53.34 180 top
JP4  87.63,53.34 180 top
JP5  75.56,53.34 180 top
JP6  50.16,53.34 180 top
JP7  131.44,112.39 0 top
JP8  187.96,53.34 180 top
JP9  38.1,53.34 180 top
JP10  12.7,53.34 180 top
JP11  162.56,53.34 180 top
K1  24.13,92.08 270 top
LED1  66.04,94.61 90 top
LED2  52.07,94.61 90 top
LED3  38.1,94.61 90 top
LED4  40.64,83.19 0 top
LED6  45.72,66.67 90 top
LPC1  175.9,114.3 180 top
Q1  68.58,97.79 180 top
Q2  54.61,97.79 180 top
Q3  40.64,97.79 180 top
Q4  147.32,66.04 0 top
Q5  34.29,85.09 270 top
R1  137.16,51.44 180 top
R2  141.6,51.44 180 top
R3  99.69,51.44 180 top
R4  104.14,51.44 180 top
R5  62.23,51.44 180 top
R6  66.67,51.44 180 top
R7  24.77,50.16 180 top
R8  29.21,50.16 180 top
R9  174.62,51.44 180 top
R10  179.07,51.44 180 top
R11  69.85,95.89 0 top
R12  69.85,93.34 0 top
R13  55.88,95.89 0 top
R14  55.88,93.34 0 top
R15  41.91,95.89 0 top
R16  41.91,93.34 0 top
R17  41.91,86.36 90 top
R18  39.37,86.36 90 top
R19  29.21,92.08 270 bottom
R20  146.69,71.12 0 top
R21  19.05,91.44 90 bottom
R23  43.18,66.04 90 top
SG1  155.57,69.85 90 top
SPINSPD  97.79,82.55 90 top
TOOLZERO  88.27,95.25 90 top
TP1  20.32,56.52 0 top
TP2  18.41,64.77 0 top
U1  174.37,91.44 270 top
U$1  24.13,29.84 270 top
U$2  61.59,29.84 270 top
U$3  99.06,29.84 270 top
U$4  136.53,29.84 270 top
U$6  192.91,59.82 90 top
U$7  31.75,65.41 0 top
U$9  173.99,29.84 270 top
U$15  132.08,68.58 0 top
U$16  114.94,68.58 0 top
U$19  7.62,67.94 0 top
X  22.86,5.08 0 top
X1  24.13,110.49 180 top
X2  180.34,83.19 180 top
X3  68.58,110.49 180 top
X4  54.61,110.49 180 top
X5  40.64,110.49 180 top
X7  6.35,110.49 180 top
XQUAD  59.69,68.58 90 top
XSTOP  60.33,82.55 90 top
Y  60.33,5.08 0 top
YQUAD  69.22,68.58 90 top
YSTOP  79.38,95.25 90 top
Z  97.79,5.08 0 top
ZQUAD  78.74,68.58 90 top
ZSTOP  79.38,107.95 90 top

### Tracks (layer width: path | path; a pad name or v marks a point on that pad's centre or on a via)
3.3V  (via drill 0.6)  (10 unrouted)
  Top 0.254: U$6.6 176.66,69.34 177.8,70.48 | U$6.3 177.29,65.53 177.8,66.04 177.8,70.48 | C5.1 173.09,75.19 177.8,70.48 | JP7.3 136.53,111.12 137.16,110.49 154.31,110.49 156.21,112.39 177.16,112.39 187.32,102.23 187.32,97.79 186.69,97.16 185.35,97.16 U1.4 181.05,97.08 180.34,97.79 v179.07,97.79
  Top 0.406: XQUAD.1 YQUAD.1 ZQUAD.1 AQUAD.1 BQUAD.1 | XSTOP.1 BSTOP.1 ADC2.1 ADC1.1 SPINSPD.1
  Bottom 0.254: LPC1.28 172.09,90.81 v179.07,97.79
  Bottom 0.61: LPC1.28 172.09,82.55 160.02,70.48 104.78,70.48 | 104.78,70.48 102.87,68.58 102.87,67.31 100.33,64.77 BQUAD.1 97.16,64.77 | 104.78,70.48 104.78,76.83 101.6,80.01 SPINSPD.1
5V  (via drill 0.6)
  Top 0.254: U$16.1 106.05,63.98 v106.05,63.5 | U$15.1 125.09,62.87 v121.28,59.05 | SG1.+ 161.22,73.1 176.53,57.78 183.51,57.78 JP8.3 | R23.2 42.12,66.89 41.91,66.67 41.91,63.23
  Top 0.305: 45.72,45.09 58.42,45.09 60.33,45.09 | 150.5,46.35 150.5,53.34 | JP6.7 44.45,52.7 44.45,50.8 45.09,50.16 45.09,45.72
  Top 0.406: JP2.1 JP2.3 JP2.5 JP2.7 120.65,54.61 117.47,51.44 117.47,45.09 | JP4.1 JP4.3 JP4.5 JP4.7 81.92,54.61 79.38,52.07 79.38,45.72 78.74,45.09 | JP6.1 JP6.3 JP6.5 JP6.7 | 140.34,45.09 132.72,45.09 | 149.22,45.09 140.34,45.09 | 132.72,45.09 117.47,45.09 | 112.39,45.09 102.87,45.09 | 117.47,45.09 112.39,45.09 | 102.87,45.09 95.25,45.09 | 66.04,45.09 60.33,45.09 | 74.3,45.09 66.04,45.09 | 78.74,45.09 74.3,45.09 | 95.25,45.09 78.74,45.09 | 149.22,45.09 150.5,46.35 | 132.72,45.09 133.99,46.35 U$4.VCC | JP10.7 JP10.5 JP10.3 JP10.1 17.78,53.34 17.78,46.35 19.05,45.09 20.32,45.09 | 153.03,45.09 149.22,45.09 | 170.81,45.09 153.03,45.09 | 178.44,45.09 170.81,45.09 | 178.44,45.09 186.69,45.09 187.96,46.35 187.96,53.34 | 178.44,45.09 179.07,45.72 U$9.RESET | 170.81,45.09 171.45,45.72 U$9.VCC | JP11.1 JP11.3 JP11.5 JP11.7 | JP11.7 164.47,54.61 | 153.03,45.09 154.31,46.35 154.31,52.07 156.84,54.61 JP11.7 | JP1.1 150.5,53.34 JP1.3 | 187.96,53.34 JP8.1 | 140.34,45.09 141.6,46.35 U$4.RESET | 113.03,53.34 JP3.3 | 113.03,53.34 113.03,45.72 112.39,45.09 | 113.03,53.34 JP3.1 | 102.87,45.09 104.14,46.35 U$3.RESET | 95.25,45.09 96.52,46.35 U$3.VCC | 75.56,53.34 JP5.3 | 75.56,53.34 75.56,46.35 74.3,45.09 | 75.56,53.34 JP5.1 | 66.04,45.09 66.67,45.72 U$2.RESET | 58.42,45.09 59.05,45.72 U$2.VCC | 27.94,45.09 20.32,45.09 | 36.83,45.09 27.94,45.09 | 44.45,45.09 36.83,45.09 | 45.72,45.09 44.45,45.09 | 44.45,45.09 45.09,45.72 | 38.1,53.34 JP9.3 | 38.1,53.34 38.1,46.35 36.83,45.09 | 38.1,53.34 JP9.1 | 27.94,45.09 29.21,46.35 U$1.RESET | 20.32,45.09 21.59,46.35 U$1.VCC | v187.96,82.55 187.96,53.34 | 187.96,53.34 JP8.3
  Top 0.813: U$7.2 36.66,63.23 41.91,63.23 C9.1 51.8,63.23 C8.+
  Bottom 0.254: v106.05,63.5 106.05,51.44 104.14,49.53 U$3.RESET | JP2.7 v121.28,59.05
  Bottom 0.406: v187.96,82.55 187.96,100.33 178.44,109.86 170.18,109.86 169.54,109.22 LPC1.2 | C8.+ 52.7,60.96 JP6.7
+24V
  Top 0.406: K1.2 19.05,84.45 D2.C | TP1.TP 20.32,57.78 18.41,59.69
  Top 0.61: F1.1 5.24,59.69 18.41,59.69 22.23,63.5 C6.+ 26.57,63.5 U$7.1 30.09,61.23 C7.1
  Top 1.676: C4.+ 12.7,6.35 8.89,10.16 U$1.VMOT2 | U$2.VMOT2 46.35,5.21 C3.+ | U$2.VMOT2 U$2.VMOT3 | U$2.VMOT2 U$2.VMOT1 | U$3.VMOT2 U$3.VMOT3 | U$3.VMOT2 U$3.VMOT1 | C2.+ 83.69,11.94 U$3.VMOT2 | U$4.VMOT2 U$4.VMOT3 | U$4.VMOT2 U$4.VMOT1 | C1.+ 121.16,11.94 U$4.VMOT2 | U$9.VMOT2 U$9.VMOT3 | U$9.VMOT2 U$9.VMOT1 | C10.+ 158.62,11.94 U$9.VMOT2 | U$1.VMOT2 U$1.VMOT1 | U$1.VMOT3 U$1.VMOT2
  Top 3.81: 3.81,67.31 F1.1 3.81,53.98 2.54,52.7 2.54,21.59 6.99,17.14 8.89,17.14 | 8.89,17.14 46.35,17.14 | 46.35,17.14 83.82,17.14 | 83.82,17.14 121.28,17.14 | 121.28,17.14 158.75,17.14 U$9.VMOT2 | U$1.VMOT2 8.89,17.14 | 46.35,17.14 U$2.VMOT2 | 83.82,17.14 U$3.VMOT2 | 121.28,17.14 U$4.VMOT2
  Bottom 0.406: D2.C 26.67,79.38 28.26,80.96 28.26,86.68 29.21,87.63 R19.2
  Bottom 1.676: R19.2 32.76,89.28 34.92,91.44 34.92,101.6 34.29,102.23 34.29,112.39
  Bottom 2.54: 43.18,112.39 34.29,112.39 15.24,112.39 12.7,109.86 12.7,93.34 8.89,87.63 8.89,69.22 3.81,64.14 F1.1 | 43.18,112.39 57.15,112.39 | 57.15,112.39 71.12,112.39 X3.1 | 57.15,112.39 X4.1 | 43.18,112.39 X5.1
ADC1
  Top 0.406: U$4.DCY1 JP2.8
ADC2
  Top 0.406: U$4.DCY2 JP2.6
ADIR
  Top 0.254: U$15.4 128.91,62.23 131.44,59.69 U$4.DIR
AENABLE
  Top 0.254: U$15.5 130.18,62.23 137.16,55.24 142.88,55.24 144.15,53.98 U$4.EN
AM1
  Top 0.406: U$4.M1 JP2.4
AM2
  Top 0.406: U$4.M2 JP2.2
ASTEP
  Top 0.254: U$15.6 131.44,62.23 137.16,56.52 142.88,56.52 146.69,52.7 U$4.CLOCK
ATQ1
  Top 0.406: U$4.TQ1 JP1.4
ATQ2
  Top 0.406: U$4.TQ2 JP1.2
BDC1
  Top 0.254: U$9.DCY1 JP11.8
BDC2
  Top 0.254: U$9.DCY2 JP11.6
BDIR
  Top 0.254: U$15.7 132.72,62.23 137.16,57.78 166.37,57.78 168.91,55.24 U$9.DIR
BENABLE
  Top 0.254: U$15.8 133.99,62.23 137.16,59.05 172.72,59.05 176.53,55.24 179.07,55.24 181.61,52.7 U$9.EN
BM1
  Top 0.254: U$9.M1 JP11.4
BM2
  Top 0.254: U$9.M2 JP11.2
BSTEP
  Top 0.254: U$15.9 135.25,62.23 137.16,60.33 172.72,60.33 176.53,56.52 179.07,56.52 184.15,51.44 U$9.CLOCK
BTQ1
  Top 0.254: U$9.TQ1 JP8.4
BTQ2
  Top 0.254: U$9.TQ2 JP8.2
D+
  Top 0.254: LPC1.37 149.22,87 149.86,87.63 172.72,87.63 177.16,83.19 179.09,83.19 X2.D+
D-
  Top 0.254: LPC1.36 151.76,86.36 152.4,87 172.09,87 177.16,81.92 178.34,81.92 X2.D-
ETHRD+
  Top 0.254: U$6.7 171.96,70.61 159.38,83.19 LPC1.33
ETHRD-
  Top 0.254: U$6.8 173.23,71.88 161.93,83.19 LPC1.32
ETHTD+
  Top 0.254: U$6.1 174.5,62.99 154.31,83.19 LPC1.35
ETHTD-
  Top 0.254: U$6.2 175.77,64.26 156.84,83.19 LPC1.34
GND  (via drill 0.6, 1.91)  (16 unrouted)
  Top 0.254: 188.92,93.98 188.92,92.89 U1.GND3 187.92,90.77 186.69,89.53 183.39,89.53 X2.P$1 179.06,89.2 U1.CD1 U1.CD2 | 188.92,93.98 U1.GND1 | U1.6 188.02,94.88 188.92,93.98 | U$15.2 126.36,66.04 125.09,67.31 | 107.95,67.31 BQUAD.2 | 109.22,67.31 107.95,67.31 | 119.38,67.31 109.22,67.31 | 120.65,67.31 119.38,67.31 | 125.09,67.31 120.65,67.31 | U$16.12 121.92,66.04 120.65,67.31 | U$16.11 120.65,66.04 119.38,67.31 | U$16.2 109.22,66.04 107.95,67.31 | U$16.22 110.49,68.58 109.22,67.31 | U$16.13 121.92,68.58 120.65,67.31 | U$15.22 127.64,68.58 126.36,67.31 | 126.36,67.31 125.09,67.31 | U$15.12 139.06,66.04 137.79,67.31 | 136.53,67.31 126.36,67.31 | 137.79,67.31 136.53,67.31 | U$15.11 137.79,66.04 136.53,67.31 | U$15.13 139.06,68.58 137.79,67.31 | Q4.3 144.78,67.31 142.88,67.31 | 142.88,67.31 137.79,67.31 | R20.1 145.84,70.27 142.88,67.31 | R10.1 179.92,52.49 v178.44,53.98 | JP7.1 131.44,110.49 132.08,109.86 154.94,109.86 156.84,111.76 170.81,111.76 172.09,110.49 LPC1.1 | C5.2 177.63,76.2 U$6.GNDR
  Top 0.406: R15.1 40.83,96.11 LED3.C Q3.S | R13.1 54.8,96.11 LED2.C Q2.S | R11.1 68.77,96.11 LED1.C Q1.S | Q5.3 34.29,88.27 36.2,90.17 | LED4.C 41.91,83.42 R17.1 41.91,78.11 41.93,78.08 | R8.1 30.06,52.28 v30.48,52.7
  Top 0.813: C8.- 51.44,66.67 48.26,69.85 | 48.26,69.85 47.62,70.48 44.45,70.48 | 44.45,70.48 34.29,70.48 31.75,67.94 31.75,67.31 | LED6.C 45.72,69.22 44.45,70.48 | 48.26,69.85 C9.2
  Top 1.93: 61.59,100.33 Q1.S | 48.26,100.33 Q2.S | 35.56,100.33 Q3.S
  Top 2.54: 61.59,100.33 61.59,91.44 60.33,90.17 54.02,90.17 49.55,85.7 | 48.26,84.42 49.55,85.7 | 48.26,84.45 48.26,90.17 | 48.26,90.17 48.26,100.33 | 49.55,85.7 48.26,84.45 | 35.56,100.33 35.56,90.81 36.2,90.17 48.26,90.17 | 48.26,84.42 48.26,84.45 | U$7.3 41.93,78.08 48.26,84.42
  Top 3.81: U$19.4 v13.97,64.14 17.78,64.14 TP2.TP 21.55,67.91 U$7.3
  Bottom 0.254: v178.44,53.98 178.44,59.44 U$6.GNDL
  Bottom 0.406: C6.- v30.48,52.7
  Bottom 0.813: C6.- 21.59,60.96 17.14,56.52 8.26,56.52 8.89,59.05 | C8.- 56.52,66.67 57.15,67.31 XQUAD.2 YQUAD.2 ZQUAD.2 AQUAD.2 BQUAD.2 | XSTOP.3 BSTOP.3 ADC2.3 ADC1.3 SPINSPD.3 LPC1.54 | Q4.3 146.05,63.5 156.21,53.34 156.21,55.24 160.78,59.82 U$6.GNDL U$6.GNDR 178.81,75.94 180.34,77.47 182.75,77.47 X2.P$2 182.88,77.34 182.88,83.19 | X2.GND 181.63,84.44 182.88,83.19 | 182.88,83.19 183.06,83.36 X2.P$1 182.88,89.38 182.88,100.33 175.26,107.95 LPC1.1
  Bottom 1.676: C4.- 8.64,5.33 2.54,11.43 2.54,21.59 | C3.- 41.91,5.08 36.83,10.16 U$1.PGND2 | U$9.PGND3 U$9.PGND2 U$9.PGND1 | C10.- 153.67,5.08 149.22,9.53 U$4.PGND2 | U$4.PGND2 U$4.PGND3 | U$4.PGND2 U$4.PGND1 | C1.- 116.2,5.08 111.76,9.53 U$3.PGND2 | U$3.PGND2 U$3.PGND1 | U$3.PGND2 U$3.PGND3 | C2.- 78.11,5.08 74.3,8.89 U$2.PGND2 | U$2.PGND2 U$2.PGND1 | U$2.PGND2 U$2.PGND3 | U$1.PGND2 U$1.PGND3 | U$1.PGND2 U$1.PGND1
  Bottom 1.778: R21.1 14.98,88.64 13.34,87 13.34,64.77
  Bottom 2.54: v13.97,64.14 13.34,64.77
  Bottom 3.81: 6.99,17.14 2.54,21.59 2.54,52.7 8.89,59.05 v13.97,64.14 | 6.99,17.14 36.83,17.14 | 36.83,17.14 45.72,17.14 | 45.72,17.14 74.3,17.14 | 74.3,17.14 111.76,17.14 | 111.76,17.14 149.22,17.14 | 149.22,17.14 186.69,17.14 U$9.PGND2 | 6.99,17.14 8.89,15.24 | 45.72,17.14 46.35,16.51 | 149.22,17.14 U$4.PGND2 | 111.76,17.14 U$3.PGND2 | 74.3,17.14 U$2.PGND2 | 36.83,17.14 U$1.PGND2
N$1
  Top 1.676: Z.2 95.81,11.36 95.1,12.06 U$3.C2 U$3.C1
N$2  (1 unrouted)
  Top 1.676: A.2 133.28,11.99 133.35,12.06 | U$4.C2 U$4.C1
N$3  (1 unrouted)
  Top 1.676: A.3 137.24,11.99 137.16,12.06 | U$4.B2 U$4.B1
N$4
  Top 1.676: A.4 141.6,5.49 U$4.A2 U$4.A1
N$5
  Top 1.676: A.1 128.91,5.49 U$4.D1 U$4.D2
N$6
  Top 3.81: F1.3 3.81,90.17 2.54,91.44 2.54,99.06 3.81,100.33 X7.2
  Bottom 3.81: X7.2 3.81,100.33 2.54,99.06 2.54,91.44 3.81,90.17 F1.3
N$7
  Top 1.676: B.2 170.74,11.36 U$9.C1 U$9.C2
N$8
  Top 0.406: R3.2 98.84,47.84 U$3.PROTECT
N$9
  Top 1.676: Z.3 99.77,11.36 U$3.B2 U$3.B1
N$10
  Top 1.676: Z.4 104.14,5.49 U$3.A2 U$3.A1
N$11
  Top 1.676: Z.1 91.44,5.49 U$3.D1 U$3.D2
N$12
  Top 1.676: B.3 174.7,11.36 U$9.B2 U$9.B1
N$13
  Top 1.676: B.4 179.07,5.49 U$9.A2 U$9.A1
N$14
  Top 1.676: B.1 166.37,5.49 U$9.D1 U$9.D2
N$15
  Bottom 1.778: X1.1 29.21,98.5 K1.NO 29.21,96.66 R19.1
N$16
  Top 0.406: R1.2 136.31,47.84 U$4.PROTECT
N$17
  Top 1.93: Q1.D 68.58,102.23 66.04,104.78 X3.2
N$18
  Top 0.406: LED1.A 68.77,93.11 R12.1
N$19
  Top 1.93: Q2.D 54.61,102.23 52.07,104.78 X4.2
N$20
  Top 0.406: LED2.A 54.8,93.11 R14.1
N$21
  Top 1.676: Y.2 58.34,11.36 U$2.C1 U$2.C2
N$22
  Top 1.676: Y.3 62.3,11.36 U$2.B2 U$2.B1
N$23
  Top 1.676: Y.4 66.67,5.49 U$2.A2 U$2.A1
N$24
  Top 1.676: Y.1 53.98,5.49 U$2.D1 U$2.D2
N$25
  Top 1.93: Q3.D 40.64,102.87 X5.2
N$26
  Top 0.406: LED3.A 40.83,93.11 R16.1
N$27
  Top 3.81: X7.1 12.7,100.97 12.7,77.95 U$19.1
N$29
  Bottom 1.778: K1.C X1.2
N$30
  Top 0.406: Q5.1 31.68,83.82 K1.1 29.21,84.45 D2.A
N$31
  Top 1.676: X.2 20.88,11.36 U$1.C1 U$1.C2
N$32
  Top 1.676: X.3 24.84,11.36 25.55,12.06 U$1.B1 U$1.B2
N$33
  Top 1.676: X.4 29.21,5.49 U$1.A2 U$1.A1
N$34
  Top 1.676: X.1 16.51,5.49 U$1.D1 U$1.D2
N$35
  Top 0.406: R18.1 39.37,83.42 LED4.A
N$37
  Bottom 1.778: X1.3 19.05,99.77 18.13,98.84 K1.NC 19.05,96.66 R21.2
N$38
  Top 0.254: Q4.1 155.01,66.04 SG1.-
N$39
  Top 0.254: R23.1 45.7,65.19 LED6.A
N$42  (1 unrouted)
  Top 0.406: 173.78,47.84 R9.2
N$43
  Top 0.406: R7.2 23.91,47.84 24.13,47.84 U$1.PROTECT
N$44
  Top 0.406: R5.2 61.38,47.84 U$2.PROTECT
P0.0
  Top 0.254: LPC1.9 151.76,91.44 147.96,87.63 147.96,80.01 142.88,74.93 137.16,74.93 136.53,74.3 U$15.15
P0.1
  Top 0.254: LPC1.10 149.22,91.44 145.41,87.63 145.41,82.55 139.7,76.83 136.53,76.83 133.99,74.3 U$15.17
P0.2
  Top 0.254: LPC1.21 121.28,109.22 120.02,110.49 102.87,110.49 100.97,112.39 87,112.39 82.55,107.95 ZSTOP.2
P0.3
  Top 0.254: LPC1.22 118.75,108.58 117.47,109.86 102.87,109.86 100.97,107.95 ASTOP.2
P0.4
  Top 0.254: U$15.16 135.25,74.3 137.16,76.2 140.34,76.2 146.69,82.55 LPC1.38
P0.5
  Top 0.254: LPC1.39 144.15,82.55 139.06,77.47 135.89,77.47 132.72,74.3 U$15.18
P0.6
  Top 0.254: U1.2 181.39,99.28 175.9,104.78 163.83,104.78 163.19,105.41 163.19,109.22 161.93,110.49 156.84,110.49 LPC1.8
P0.7
  Top 0.254: LPC1.7 158.12,109.22 160.02,109.22 160.66,108.58 160.66,104.14 162.56,102.23 175.9,102.23 177.16,100.97 177.16,97.16 178.34,95.98 U1.5
P0.8
  Top 0.254: LPC1.6 159.38,104.14 162.56,100.97 175.9,100.97 176.53,100.33 176.53,95.89 178.63,93.78 U1.7
P0.9
  Top 0.254: U1.3 181.22,98.18 175.9,103.5 162.56,103.5 161.93,104.14 LPC1.5
P0.10
  Top 0.254: U$15.20 130.18,74.3 134.62,78.74 137.79,78.74 141.6,82.55 LPC1.40
P0.11
  Top 0.254: LPC1.41 139.06,82.55 136.53,80.64 133.99,80.64 128.91,75.56 121.28,75.56 120.65,74.93 U$16.14
P0.15
  Bottom 0.254: LPC1.13 JP7.5
P0.16
  Bottom 0.254: LPC1.14 JP7.4
P0.17
  Top 0.254: U$15.21 128.91,74.3 133.99,79.38 137.16,79.38 140.34,82.55 140.34,87.63 144.15,91.44 LPC1.12
P0.18
  Top 0.254: U$15.19 131.44,74.3 135.25,78.11 138.43,78.11 142.88,82.55 142.88,87.63 146.69,91.44 LPC1.11
P0.19
  Top 0.254: DOOR.2 98.42,95.25 105.09,101.92 107.3,101.92 LPC1.57
P0.20  (1 unrouted)
P0.21  (1 unrouted)
P0.22  (1 unrouted)
P0.23  (via drill 0.6)
  Top 0.254: U$19.2 16.69,75.39 v17.78,74.3
  Bottom 0.254: v17.78,74.3 18.41,74.3 19.05,73.66 27.3,73.66 37.47,83.82 37.47,90.81 49.53,102.87 71.75,102.87 74.93,106.05 74.93,110.49 77.47,113.03 128.27,113.03 130.81,110.49 135.25,110.49 136.53,109.22 LPC1.15
P0.24  (via drill 0.6)
  Top 0.254: U$19.3 16.69,70.66 v17.78,71.75
  Bottom 0.254: v17.78,71.75 18.41,71.75 19.68,73.03 27.94,73.03 38.1,83.19 38.1,90.17 50.16,102.23 72.39,102.23 75.56,105.41 75.56,109.86 78.11,112.39 127.64,112.39 130.18,109.86 133.35,109.86 133.99,109.22 LPC1.16
P0.25  (1 unrouted)
P0.26  (1 unrouted)
P0.27  (1 unrouted)
P0.28  (1 unrouted)
P1.20
  Top 0.254: U$16.20 113.03,74.93 117.47,79.38 125.09,79.38 125.09,88.9 123.5,90.5 LPC1.71
P1.23
  Top 0.254: U$16.18 115.57,74.93 118.75,78.11 126.36,78.11 127.64,79.38 127.64,91.44 126.03,93.04 LPC1.68
P1.24  (1 unrouted)
  Top 0.406: R17.2 R18.2 37.68,87.21 36.2,85.72 Q5.2
P1.25  (1 unrouted)
  Top 0.254: R20.2 147.53,68.16 Q4.2
P1.26
  Top 0.254: LPC1.65 126.03,95.58 130.18,91.44 130.18,79.38 127.64,76.83 120.02,76.83 118.11,74.93 U$16.16
P1.27  (1 unrouted)
  Top 0.406: R9.1 R10.2
P1.28  (1 unrouted)
  Top 0.406: R1.1 R2.2
P1.29
  Top 0.254: LPC1.62 126.03,98.12 132.72,91.44 132.72,80.64 128.27,76.2 120.65,76.2 119.38,74.93 U$16.15
P1.30
  Top 0.254: XSTOP.2 63.5,82.55 64.14,83.19 64.14,87.63 67.31,90.81 71.12,90.81 76.2,95.89 76.2,107.95 77.47,109.22 82.55,109.22 86.36,113.03 123.19,113.03 126.36,109.86 LPC1.19
P1.31
  Top 0.254: YSTOP.2 80.64,95.25 81.92,96.52 81.92,100.97 83.82,102.87 99.06,102.87 101.6,105.41 101.6,106.68 104.14,109.22 116.84,109.22 117.47,108.58 117.47,106.68 118.11,106.05 121.92,106.05 LPC1.20
P2.0  (1 unrouted)
  Top 0.406: R12.2 R11.2 71.12,96.31 Q1.G
P2.1  (1 unrouted)
  Top 0.406: R14.2 R13.2 57.15,96.31 Q2.G
P2.2  (1 unrouted)
  Top 0.406: R16.2 R15.2 43.18,96.31 Q3.G
P2.3
  Top 0.254: U$16.17 116.84,74.93 119.38,77.47 127,77.47 128.91,79.38 LPC1.45
P2.4
  Top 0.254: LPC1.46 126.36,79.38 125.73,78.74 118.11,78.74 114.3,74.93 U$16.19
P2.5
  Top 0.254: LPC1.47 123.83,81.28 122.56,80.01 116.84,80.01 111.76,74.93 U$16.21
P2.6  (1 unrouted)
P2.7  (1 unrouted)
P2.8  (1 unrouted)
P2.10  (1 unrouted)
P2.11  (1 unrouted)
P2.12  (1 unrouted)
P2.13  (1 unrouted)
P3.25  (1 unrouted)
  Top 0.406: R3.1 R4.2
P3.26  (1 unrouted)
  Top 0.406: R5.1 R6.2
P4.28  (1 unrouted)
  Top 0.406: R7.1 R8.2
P4.29
  Top 0.254: TOOLZERO.2 91.44,95.25 92.71,96.52 92.71,100.33 93.98,101.6 102.87,101.6 104.14,102.87 105.72,102.87 LPC1.58
XDC1
  Top 0.406: U$1.DCY1 JP10.8
XDC2
  Top 0.406: U$1.DCY2 JP10.6
XDIR
  Top 0.254: U$16.3 110.49,62.23 109.86,61.59 38.1,61.59 31.11,54.61 29.84,54.61 29.21,53.98 29.21,52.7 27.94,51.44 20.32,51.44 19.05,50.16 U$1.DIR
XENABLE
  Top 0.254: U$16.4 111.76,62.23 110.49,60.96 38.73,60.96 31.75,53.98 U$1.EN
XM1
  Top 0.406: U$1.M1 JP10.4
XM2
  Top 0.406: U$1.M2 JP10.2
XSTEP
  Top 0.254: U$16.5 113.03,62.23 111.12,60.33 39.37,60.33 34.29,55.24 U$1.CLOCK
XTQ1
  Top 0.406: U$1.TQ1 JP9.4
XTQ2
  Top 0.406: U$1.TQ2 JP9.2
YDC1
  Top 0.406: U$2.DCY1 JP6.8
YDC2
  Top 0.406: U$2.DCY2 JP6.6
YDIR
  Top 0.254: U$16.6 114.3,62.23 111.76,59.69 60.96,59.69 56.52,55.24 U$2.DIR
YENABLE
  Top 0.254: U$16.7 115.57,62.23 112.39,59.05 71.12,59.05 69.22,57.15 U$2.EN
YM1
  Top 0.406: U$2.M1 JP6.4
YM2
  Top 0.406: U$2.M2 JP6.2
YSTEP
  Top 0.254: U$16.8 116.84,62.23 113.03,58.42 73.03,58.42 71.75,57.15 U$2.CLOCK
YTQ1
  Top 0.406: U$2.TQ1 JP5.4
YTQ2
  Top 0.406: U$2.TQ2 JP5.2
ZDC1
  Top 0.406: U$3.DCY1 JP4.8
ZDC2
  Top 0.406: U$3.DCY2 JP4.6
ZDIR
  Top 0.254: 118.11,63.5 U$16.9 118.11,62.23 113.67,57.78 95.89,57.78 93.98,55.88 U$3.DIR
ZENABLE
  Top 0.254: 119.38,63.5 U$16.10 119.38,62.23 114.3,57.15 109.22,57.15 106.68,54.61 U$3.EN
ZM1
  Top 0.406: U$3.M1 JP4.4
ZM2
  Top 0.406: U$3.M2 JP4.2
ZSTEP
  Top 0.254: U$15.3 127.64,62.23 121.92,56.52 111.12,56.52 109.22,54.61 U$3.CLOCK
ZTQ1
  Top 0.406: U$3.TQ1 JP3.4
ZTQ2
  Top 0.406: U$3.TQ2 JP3.2

### Text on the board
tPlace: M2 | OFF | OFF | ON | ON | T2 | OFF | OFF | OFF | ON | D2 | OFF | OFF | ON | ON | M1 | T1 | D1 | OFF | ON | OFF | ON | OFF | ON | ON | OFF | OFF | ON | ON | ON | Copyright 2012 | FULL | HALF | 1/4 | 1/8 | TORQUE | 100% | 75% | 50% | 25% | DECAY | NORMAL 0% | 25% | 50% | 100% | BOTSTEP23 | CONFIGURATION | STEP MODE | License: GPLv3 | Documentation: http://bit.ly/???? | revA | Design by: Zach Hoeken / Hoektronics Inc. | HoekStep23 CNC Controller | Z ENDSTOP | Y ENDSTOP | X ENDSTOP | 5mm Fuse - 15A | X AXIS | Y AXIS | Z AXIS | A AXIS | B AXIS | D1 | D2 | M1 | M2 | T1 | T2 | D1 | D2 | M1 | M2 | T1 | T2 | D1 | D2 | M1 | M2 | T1 | T2 | D1 | D2 | M1 | M2 | T1 | T2 | D1 | D2 | M1 | M2 | T1 | T2